# Altium schematic sheet 6-E2p&RTC.SchDoc
size A4
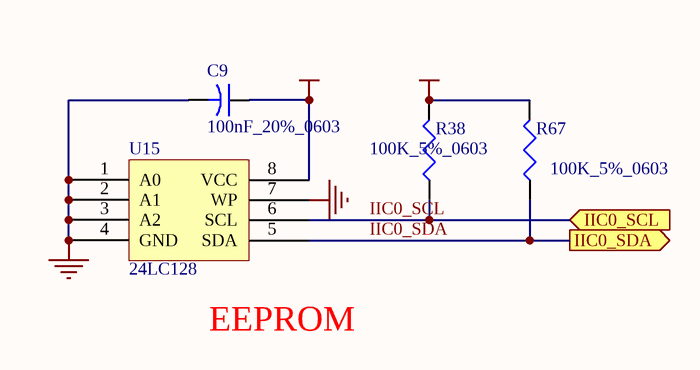
[diagram p0: 6-E2p&RTC.SchDoc]

## Parts
C9  100nF_20%_0603  [C1608-0603]
R38  100K_5%_0603  [C1608-0603]
R67  100K_5%_0603  [C1608-0603]
U15  24LC128  [8s1]

## Ports
IIC0_SCL (in), IIC0_SDA (out)

## Nets
GND: C9.2 U15.1(A0) U15.2(A1) U15.3(A2) U15.4(GND) U15.7(WP)
VCC_2V8: C9.1 R38.2 R67.2 U15.8(VCC)
IIC0_SCL: R38.1 U15.6(SCL) ; port IIC0_SCL
IIC0_SDA: R67.1 U15.5(SDA) ; port IIC0_SDA

## Notes on the sheet
- (near U15) EEPROM

## Library data of the parts
C9 = Cap2: Capacitor; Value: 0.1uF 0603; Published: 23-Sep-2002; Publisher: Altium Limited
R38 R67 = Res3: Resistor; Value: 1K%5 0603; Published: 8-Jun-2000; Revision: July-2002: Re-released for DXP Platform.; Publisher: Altium Limited
U15 = 24LC02: IC